# Altium project high-speed-thermocouple-logger.PrjPcb (part 2 of 3)

## Sheet power.SchDoc: tclogger
size A4; Date: 2024-05-30; CheckedBy: Boris Botev; DrawnBy: Iliyan Antov; Organization: Medical Technologies CZ a.s.; Revision: 100; SheetNumber: 3; SheetTotal: 10; Version1: N/A; Version2: N/A; Version3: N/A; Change1description: N/A; Change2description: N/A; Change3description: N/A; Change1DrawnBy: N/A; Change2DrawnBy: N/A; Change3DrawnBy: N/A; Change1CheckedBy: N/A; Change2CheckedBy: N/A; Change3CheckedBy: N/A; PreviusVersion_Chng1: N/A; PreviusVersion_Chng2: N/A; PreviusVersion_Chng3: N/A; Variant1description: Standard assembly; Variant2description: N/A; Variant3description: N/A; Variant4description: N/A; PrimaryCard1: XXXxxxXXX; PrimaryCard2: N/A; PrimaryCard3: N/A; PrimaryCard4: N/A; SPICEModelCachePWZRLVOU: <root> / <DocumentId>PWZRLVOU</DocumentId> / <CacheFrame Number="0"> / <Model Name="grm188r72a104ka35" Kind="CKT"> / <Text>*---------------------------------------------------------------------- / * SPICE Model generated by Murata Manufacturing Co., Ltd. / * Copyright(C) Murata Manufacturing Co., Ltd. / * Description :1608M(0603)/X7R/0.1uF/100V / * Murata P/N :GRM188R72A104KA35 / * Property : C = 0.1[uF] / *---------------------------------------------------------------------- / * Applicable Conditions: / *   Frequency Range = 100Hz-6GHz / *   Temperature = 25 degC / *   DC Bias Voltage = 0V / *   Small Signal Operation / *---------------------------------------------------------------------- / .SUBCKT GRM188R72A104KA35 port1 port2 / C1 port1 11 9.94e-8 / L2 11 12 1.68e-10 / R3 12 13 1.35e-2 / C4 13 14 1.39e-5 / R4 13 14 285 / C5 14 15 2.35e-5 / R5 14 15 28.5 / C6 15 16 1.88e-5 / R6 15 16 7.00 / C7 16 17 1.68e-5 / R7 16 17 9.47e-1 / C8 17 18 1.50e-5 / R8 17 18 1.51e-1 / C9 18 19 1.07e-5 / R9 18 19 2.98e-2 / C10 19 20 1.31e-5 / R10 19 20 3.83e-3 / L11 20 21 1.43e-11 / R11 20 21 8.15e-2 / L12 21 22 1.08e-10 / R12 21 22 7.26e-2 / C13 22 23 4.76e-7 / L13 22 23 2.94e-11 / R13 22 23 3.05e-2 / C14 23 24 1.58e-7 / L14 23 24 2.63e-11 / R14 23 24 2.63e-2 / C15 24 port2 3.33e-12 / L15 24 port2 1.14e-10 / R15 24 port2 22.5 / R100 port1 11 5.00e+9 / .ENDS GRM188R72A104KA35</Text> / </Model> / <Model Name="ssa34" Kind="CKT"> / <Text>********************************** / * Copyright:                     * / *   Thomatronik GmbH, Germany    * / *   info@thomatronik.de          * / ********************************** / *   SPICE3 / .subckt ssa34 1 2 / ddio 1 2 legd / dgr 1 2 grd / .model legd d is = 1.73647E-006 n = 1.01682 rs = 0.0395584 / + eg = 0.4 xti = 0.200031 tnom = 27 / + cjo = 8.10972E-010 vj = 0.700021 m = 0.588084 fc = 0.5 / + tt = 1.4427E-009 bv = 44 ibv = 1 af = 1 kf = 0 / .model grd d is = 6.76885E-008 n = 0.972506 rs = 0.0698092 / + eg = 1 xti = 0.2 tnom = 27 / .ends</Text> / </Model> / <Model Name="grt188r61h105ke13" Kind="CKT"> / <Text>*---------------------------------------------------------------------- / * SPICE Model generated by Murata Manufacturing Co., Ltd. / * Copyright(C) Murata Manufacturing Co., Ltd. / * Description :1608M(0603)/X5R/1uF/50V / * Murata P/N :GRT188R61H105KE13 / * Property : C = 1[uF] / *---------------------------------------------------------------------- / * Applicable Conditions: / *   Frequency Range = 100Hz-6GHz / *   Temperature = 25 degC / *   DC Bias Voltage = 5V / *   Small Signal Operation / *---------------------------------------------------------------------- / .SUBCKT GRT188R61H105KE13 port1 port2 / C1 port1 11 7.62e-7 / L2 11 12 1.16e-10 / R3 12 13 7.65e-3 / C4 13 14 3.94e-6 / R4 13 14 1.77e+3 / C5 14 15 1.75e-5 / R5 14 15 15.4 / C6 15 16 1.51e-5 / R6 15 16 1.76 / C7 16 17 1.17e-5 / R7 16 17 2.01e-1 / C8 17 18 8.13e-6 / R8 17 18 2.61e-2 / L9 18 19 2.29e-11 / R9 18 19 8.12e-2 / L10 19 20 1.53e-10 / R10 19 20 4.15e-2 / C11 20 21 2.62e-6 / L11 20 21 3.15e-11 / R11 20 21 1.12e-2 / C12 21 22 7.84e-7 / L12 21 22 5.54e-11 / R12 21 22 1.32e-2 / C13 22 port2 1.55e-12 / L13 22 port2 1.73e-10 / R13 22 port2 64.4 / R100 port1 11 5.00e+7 / .ENDS GRT188R61H105KE13</Text> / </Model> / <Model Name="c1608c0g1h103j080aa_p" Kind="CKT"> / <Text>*---------------------------------------------------------------------- / * SPICE Netlist Generated by TDK Corporation / * Copyright(C) 2015 TDK Corporation. / * All Rights Reserved. / *---------------------------------------------------------------------- / * TDK P/N: C1608C0G1H103J080AA (Multilayer Ceramic Chip Capacitor) / * Property: C=10nF / * Size(LxWxT): 1.6x0.8x0.8mm, 0.063x0.031x0.031inches / * Model Type: Precise Model / * Model Generated on June 29, 2015 / *---------------------------------------------------------------------- / * Terms and conditions regarding TDK Simulation Models: / * 1)This simulation model is being provided solely for informational / *   purposes. Please refer to the specifications of the products in / *   terms of detailed characteristics of such products. / * 2)In no event shall TDK Corporation of any of its subsidiaries be / *   liable for any loss or damage arising, directly or indirectly, / *   from any information contained in this simulation model, including, / *   but not limited to loss or damages arising from any inaccuracies, / *   omissions or errors in connection with such information. / * 3)Any and all copyrights on this simulation model are owned by / *   TDK Corporation.  Duplication or redistribution of this simulation / *   model without prior written permission from TDK Corporation / *   is prohibited. / * 4)This simulation model is subject to any modification or change / *   without any prior notice. / * 5)Neither TDK Corporation nor any of its subsidiaries shall make any / *   warranty, express or implied, including but not limited to the / *   correctness, implied warranties of merchantability and fitness for / *   a particular purpose with respect to this simulation models. / * 6)The use of this simulation model shall be deemed to have consented / *   to the terms and conditions hereof. / *---------------------------------------------------------------------- / * External Node Assignments: / * / *  n1 ---| |--- n2 / * / *---------------------------------------------------------------------- / * Applicable Conditions: / *   Temperature = 25 degC / *   DC Bias Voltage = 0 V / *   Small Signal Operation / *---------------------------------------------------------------------- / .SUBCKT C1608C0G1H103J080AA_p n1 n2 / C1 n1 11 1.00000000E-08 / L1 11 12 3.87447524E-10 / L2 12 13 3.02537762E-11 / L3 13 14 6.87230213E-11 / L4 14 15 1.66916342E-10 / L5 15 16 4.94708926E-10 / R1 n2 12 7.79169483E-02 / R2 n2 13 3.60336449E-02 / R3 n2 14 1.66641994E-02 / R4 n2 15 7.70656268E-03 / R5 n2 16 3.56399409E-03 / R6 n1 11 1.00000000E+10 / .ENDS C1608C0G1H103J080AA_p</Text> / </Model> / <Model Name="c1608x7r1h474k080ac_p" Kind="CKT"> / <Text>*---------------------------------------------------------------------- / * SPICE Netlist Generated by TDK Corporation / * Copyright(C) 2015 TDK Corporation. / * All Rights Reserved. / *---------------------------------------------------------------------- / * TDK P/N: C1608X7R1H474K080AC (Multilayer Ceramic Chip Capacitor) / * Property: C=470nF / * Size(LxWxT): 1.6x0.8x0.8mm, 0.063x0.031x0.031inches / * Model Type: Precise Model / * Model Generated on June 29, 2015 / *---------------------------------------------------------------------- / * Terms and conditions regarding TDK Simulation Models: / * 1)This simulation model is being provided solely for informational / *   purposes. Please refer to the specifications of the products in / *   terms of detailed characteristics of such products. / * 2)In no event shall TDK Corporation of any of its subsidiaries be / *   liable for any loss or damage arising, directly or indirectly, / *   from any information contained in this simulation model, including, / *   but not limited to loss or damages arising from any inaccuracies, / *   omissions or errors in connection with such information. / * 3)Any and all copyrights on this simulation model are owned by / *   TDK Corporation.  Duplication or redistribution of this simulation / *   model without prior written permission from TDK Corporation / *   is prohibited. / * 4)This simulation model is subject to any modification or change / *   without any prior notice. / * 5)Neither TDK Corporation nor any of its subsidiaries shall make any / *   warranty, express or implied, including but not limited to the / *   correctness, implied warranties of merchantability and fitness for / *   a particular purpose with respect to this simulation models. / * 6)The use of this simulation model shall be deemed to have consented / *   to the terms and conditions hereof. / *---------------------------------------------------------------------- / * External Node Assignments: / * / *  n1 ---| |--- n2 / * / *---------------------------------------------------------------------- / * Applicable Conditions: / *   Temperature = 25 degC / *   DC Bias Voltage = 0 V / *   Small Signal Operation / *---------------------------------------------------------------------- / .SUBCKT C1608X7R1H474K080AC_p n1 n2 / C1 n1 11 4.47810483E-07 / C2 n1 12 5.67609918E-09 / C3 n1 13 5.67609918E-09 / C4 n1 14 5.67609918E-09 / C5 n1 15 5.67609918E-09 / C6 n1 16 5.67609918E-09 / C7 n1 17 5.67609918E-09 / L1 n2 21 4.20000000E-10 / R1 11 21 9.27347124E-03 / R2 11 12 5.00450244E+01 / R3 11 13 3.23698218E+02 / R4 11 14 2.09308839E+03 / R5 11 15 1.35302521E+04 / R6 11 16 8.74376255E+04 / R7 11 17 5.64895275E+05 / R8 n1 11 1.06000000E+09 / .ENDS C1608X7R1H474K080AC_p</Text> / </Model> / </CacheFrame> / </root>; DocumentName: Docname
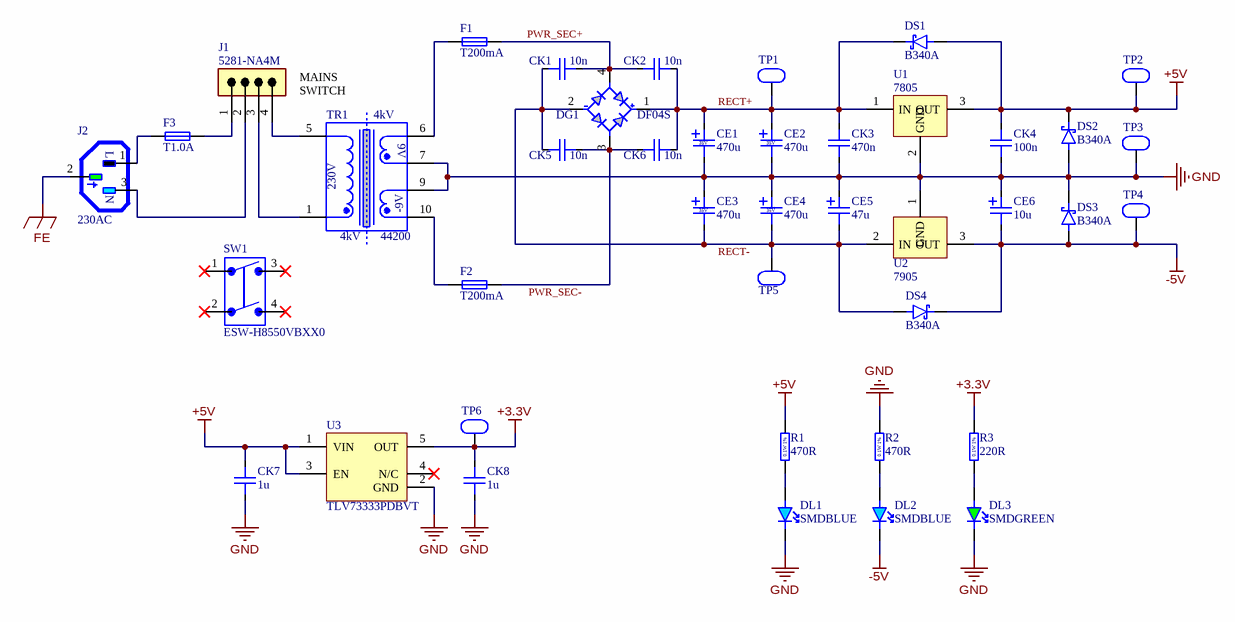
[diagram p5: power.SchDoc]

### Parts
CE1  470u  SCH_INFO: 35V
CE2  470u  SCH_INFO: 35V
CE3  470u  SCH_INFO: 35V
CE4  470u  SCH_INFO: 35V
CE5  47u  [CAPAE6.8X6.8(D_SIZE)]
CE6  10u  [CAPAE5.5X5.5(C_SIZE)]
CK1  10n  [CAPC1608X09N(SMC0603)]
CK2  10n  [CAPC1608X09N(SMC0603)]
CK3  470n  [CAPC1608X09N(SMC0603)]
CK4  100n  [CAPC1608X09N(SMC0603)]
CK5  10n  [CAPC1608X09N(SMC0603)]
CK6  10n  [CAPC1608X09N(SMC0603)]
CK7  1u  [CAPC1608X09N(SMC0603)]
CK8  1u  [CAPC1608X09N(SMC0603)]
DG1  DF04S  [DIP300RM5.08_SMD]
DL1  SMDBLUE  [DIOC2012X12N(SMLED0805)B]
DL2  SMDBLUE  [DIOC2012X12N(SMLED0805)B]
DL3  SMDGREEN  [DIOC2012X12N(SMLED0805)G]
DS1  B340A  [DIOM5127X23N(SMA)]
DS2  B340A  [DIOM5127X23N(SMA)]
DS3  B340A  [DIOM5127X23N(SMA)]
DS4  B340A  [DIOM5127X23N(SMA)]
F1  T200mA  [FUSE-C8.5]
F2  T200mA  [FUSE-C8.5]
F3  T1.0A  [FUSE-C8.5]
J1  5281-NA4M  [4P-NA-5.08]
J2  230AC  [SCHURTER_GSP1.8501.1]
R1  470R  SCH_INFO: 0.1W 1%  [RESC1608X06N(SMR0603)]
R2  470R  SCH_INFO: 0.1W 1%  [RESC1608X06N(SMR0603)]
R3  220R  SCH_INFO: 0.1W 1%  [RESC1608X06N(SMR0603)]
SW1  ESW-H8550VBXX0
TP1  Test Point  [SMD_Testpoint_Onelayer]  (value not drawn)
TP2  Test Point  [SMD_Testpoint_Onelayer]  (value not drawn)
TP3  Test Point  [SMD_Testpoint_Onelayer]  (value not drawn)
TP4  Test Point  [SMD_Testpoint_Onelayer]  (value not drawn)
TP5  Test Point  [SMD_Testpoint_Onelayer]  (value not drawn)
TP6  Test Point  [SMD_Testpoint_Onelayer]  (value not drawn)
TR1  44200  [44200]
U1  7805  [DPAK254P1544X483-3N(D2PAK)]
U2  7905  [DPAK254P1544X483-3N(D2PAK)]
U3  TLV73333PDBVT  [SOT95P280X145-5N(SOT23-5)]

### Nets
+3.3V: CK8.1 R3.2 TP6.1 U3.5(OUT)
+5V: CK4.1 CK7.1 DS1.2(A) DS2.1(C) R1.2 TP2.1 U1.3(OUT) U3.1(VIN) U3.3(EN)
-5V: CE6.2 DL2.1(C) DS3.2(A) DS4.1(C) TP4.1 U2.3(OUT)
FE: J2.2
GND: CE1.2 CE2.2 CE3.1 CE4.1 CE5.1 CE6.1 CK3.2 CK4.2 CK7.2 CK8.2 DL1.1(C) DL3.1(C) DS2.2(A) DS3.1(C) R2.2 TP3.1 TR1.7 TR1.9 U1.2(GND) U2.1(GND) U3.2(GND)
PWR_SEC+: CK1.2 CK2.1 DG1.4(AC) F1.2
PWR_SEC-: CK5.2 CK6.1 DG1.3(AC) F2.2
RECT+: CE1.1 CE2.1 CK2.2 CK3.1 CK6.2 DG1.1(+) DS1.1(C) TP1.1 U1.1(IN)
RECT-: CE3.2 CE4.2 CE5.2 CK1.1 CK5.1 DG1.2(-) DS4.2(A) TP5.1 U2.2(IN)
NetDL1_2: DL1.2(A) R1.1
NetDL2_2: DL2.2(A) R2.1
NetDL3_2: DL3.2(A) R3.1
NetF1_1: F1.1 TR1.6
NetF2_1: F2.1 TR1.10
NetF3_1: F3.1 J2.1
NetF3_2: F3.2 J1.1
NetJ1_2: J1.2 J2.3
NetJ1_3: J1.3 TR1.1
NetJ1_4: J1.4 TR1.5

Not connected (* = marked no-connect by the designer): SW1 1* 2* 3* 4*; U3 4(N/C)*

### Notes on the sheet
- MAINS SWITCH
- Číslo výkresu /drawing number/:
- Nazev listu/sheet name/:
- DPS projekt/PCB project/:
- Kreslil /drawn by/ :
- Kontroloval /checked by/:
- Datum /date/:
- List /sheet/:
- /
- (in symbol 44200) 4kV; 9V; 230V; -9V
- (in symbol EJ-GSP1SC1) L; N

### Library data of the parts
CE1-CE4 = ECE-470U35VXXM: C; 470u; 35V; 20%; Aluminum Electrolytic; ??;; Manufacturer: SU'SCON: SL035M471G16T008P50R;;SU'SCON: SL035M471G16SR;;SAMWHA: SD1V477M1012MPA159;;SAMWHA: SD1V477M1012MPA186; Component_Class: Capacitor; Status_I: Production; Status_II: Active; Tolerance_Pct: 20; Voltage_Rating_V: 35; Capacitance_F: 0.00047; Resistance_Ohm: 0.039; KK: ECE-470U35VXXM; Value: 470u; SMD: 0; ComponentLink2URL: i:\datasheets\ECE-470U35VXXM_Jamicon.pdf; ComponentLink2Description: ECE-470U35VXXM_Jamicon.pdf; Dielectric_Type: Aluminum Electrolytic; ComponentLink1URL: heliosgreen://v1/hegMT/5-MT/Classes(343)/Folders/OpenForm?RecordNumbers=[380299]; ComponentLink1Description: Helios; ComponentLink3URL: i:\datasheets\ECE-470U35VXXM_SamwhaEN100.pdf; ComponentLink3Description: ECE-470U35VXXM_SamwhaEN100.pdf
CE5 = ECE+47U35VXX0: C; 47u; 35V; 20%; Aluminum Electrolytic; ??;; Manufacturer: Surge, MPN: SVZ21V470M0605V1; Component_Class: Capacitor; Status_I: Production; Status_II: Active; Tolerance_Pct: 20; Voltage_Rating_V: 35; Capacitance_F: 4.7E-5; KK: ECE+47U35VXX0; Value: 47u; SMD: 1; ComponentLink2URL: I:\DataSheets\ECE+47U35VXX0_SurgeEN100.pdf; ComponentLink2Description: ECE+47U35VXX0_SurgeEN100.pdf; Dielectric_Type: Aluminum Electrolytic; ComponentLink1URL: heliosgreen://v1/hegMT/5-MT/Classes(343)/Folders/OpenForm?RecordNumbers=[18329439]; ComponentLink1Description: Helios
CE6 = ECE+10U35VXXM: C; 10u; 35V; 20%; Aluminum Electrolytic; ??;; Manufacturer: SAMWHA: SC1V106M05005VR259;;SAMWHA: SC1V106M05005VR289; Component_Class: Capacitor; Status_I: Production; Status_II: Active; Tolerance_Pct: 20; Voltage_Rating_V: 35; Capacitance_F: 1E-5; KK: ECE+10U35VXXM; Value: 10u; SMD: 1; ComponentLink2URL: i:\datasheets\ECE+10U35VXXM_Nippon.pdf; ComponentLink2Description: ECE+10U35VXXM_Nippon.pdf; ComponentLink3URL: i:\datasheets\ECE+10U35VXXM_Jamicon.pdf; ComponentLink3Description: ECE+10U35VXXM_Jamicon.pdf; ComponentLink4URL: i:\datasheets\ECE+10U35VXXM_Panasonic_serie_ECEV.pdf; ComponentLink4Description: ECE+10U35VXXM_Panasonic_serie_ECEV.pdf; ComponentLink5URL: i:\DataSheets\ECE+10U35VXXM_Shamwha.pdf; ComponentLink5Description: ECE+10U35VXXM_Shamwha.pdf; ComponentLink6URL: i:\DataSheets\SMD_parts_pictures\ECE+10U35VXXM-a.jpg; ComponentLink6Description: ECE+10U35VXXM-a.jpg; ComponentLink7URL: i:\DataSheets\SMD_parts_pictures\ECE+10U35VXXM-b.jpg; ComponentLink7Description: ECE+10U35VXXM-b.jpg; ComponentLink8URL: i:\DataSheets\SMD_parts_pictures\ECE+10U35VXXM-c.jpg; ComponentLink8Description: ECE+10U35VXXM-c.jpg; Resistance_Ohm: 20; Dielectric_Type: Aluminum Electrolytic; ComponentLink1URL: heliosgreen://v1/hegMT/5-MT/Classes(343)/Folders/OpenForm?RecordNumbers=[380259]; ComponentLink1Description: Helios
CK1 CK2 CK5 CK6 = ECK+10N50V0603XX0: C; 10n; 50V; 5%; NP0/C0G; ??;; Manufacturer: TDK: C1608C0G1H103J080AA; Component_Class: Capacitor; Status_I: Production; Status_II: Do not order. Upon confirmation.; Tolerance_Pct: 5; Voltage_Rating_V: 50; Capacitance_F: 1E-8; KK: ECK+10N50V0603XX0; Value: 10n; SMD: 1; ComponentLink2URL: I:\DataSheets\ECK+10N50V0603XX0_TdkEN100.pdf; ComponentLink2Description: ECK+10N50V0603XX0_TdkEN100.pdf; Dielectric_Type: NP0/C0G; ComponentLink1URL: heliosgreen://v1/hegMT/5-MT/Classes(343)/Folders/OpenForm?RecordNumbers=[12587254]; ComponentLink1Description: Helios
CK3 = ECK+470N50V0603XXK: C; 470n; 50V; 10%; X7R; ??;; Manufacturer: TDK: C1608X7R1H474KT-S;;TDK: C1608X7R1H474KT000E;;TDK: C1608X7R1H474K080AC; Note: X7R: 440n @ 5V, 330n @ 12V, 170n @ 25V (TDK); Component_Class: Capacitor; Status_I: Production; Status_II: Active; Tolerance_Pct: 10; Voltage_Rating_V: 50; Capacitance_F: 4.7E-7; KK: ECK+470N50V0603XXK; Value: 470n; SMD: 1; ComponentLink2URL: i:\datasheets\ECK+470N50V0603XXK_TDKEN100.pdf; ComponentLink2Description: ECK+470N50V0603XXK_TDKEN100.pdf; Dielectric_Type: X7R; ComponentLink1URL: heliosgreen://v1/hegMT/5-MT/Classes(343)/Folders/OpenForm?RecordNumbers=[6094421]; ComponentLink1Description: Helios
CK4 = ECK+100N100VXX0: C; 100n; 100V; 10%; X7R; ??;; Manufacturer: Murata Electronics: GRM188R72A104KA35D;;Yageo: CC0603KRX7R0BB104; Component_Class: Capacitor; Status_I: Production; Status_II: Active; Tolerance_Pct: 10; Voltage_Rating_V: 100; Capacitance_F: 1E-7; KK: ECK+100N100VXX0; Value: 100n; SMD: 1; ComponentLink2URL: I:\DataSheets\ECK+100N100VXX0_MurataEN100.pdf; ComponentLink2Description: ECK+100N100VXX0_MurataEN100.pdf; ComponentLink3URL: I:\DataSheets\ECK+100N100VXX0_YageoEN100.pdf; ComponentLink3Description: ECK+100N100VXX0_YageoEN100.pdf; ComponentLink4URL: i:\DataSheets\ECK+100N100VXX0_2_MurataEN100.pdf; ComponentLink4Description: ECK+100N100VXX0_2_MurataEN100.pdf; ComponentLink5URL: i:\DataSheets\ECK+100N100VXX0_2_YageoEN100.pdf; ComponentLink5Description: ECK+100N100VXX0_2_YageoEN100.pdf; Dielectric_Type: X7R; ComponentLink1URL: heliosgreen://v1/hegMT/5-MT/Classes(343)/Folders/OpenForm?RecordNumbers=[10556034]; ComponentLink1Description: Helios
CK7 CK8 = ECK+1U50VXX0: C; 1u; 50V; 10%; X5R; ??;; Manufacturer: TDK: C1608X5R1H105K080AB;;TDK: CGA3E3X5R1H105K080AB;;Murata: GRT188R61H105KE13D;;AVX: 06035D105KAT2A; Note: X5R: 0.52uF @ 10V, 0.2uF @ 25V (Murata); Component_Class: Capacitor; Status_I: Production; Status_II: Active; Tolerance_Pct: 10; Voltage_Rating_V: 50; Capacitance_F: 1E-6; KK: ECK+1U50VXX0; Value: 1u; SMD: 1; ComponentLink2URL: i:\DataSheets\ECK+1U50VXX0_TDKEN100.pdf; ComponentLink2Description: ECK+1U50VXX0_TDKEN100.pdf; ComponentLink3URL: I:\DataSheets\ECK+1U50VXX0_AVX_EN100.pdf; ComponentLink3Description: ECK+1U50VXX0_AVX_EN100.pdf; ComponentLink4URL: I:\DataSheets\ECK+1U50VXX0_MurataEN100.pdf; ComponentLink4Description: ECK+1U50VXX0_MurataEN100.pdf; ComponentLink5URL: I:\DataSheets\ECK+1U50VXX0_TDK_EN101.pdf; ComponentLink5Description: ECK+1U50VXX0_TDK_EN101.pdf; ComponentLink6URL: i:\DataSheets\ECK+1U50VXX0_2_AVX_EN100.pdf; ComponentLink6Description: ECK+1U50VXX0_2_AVX_EN100.pdf; Dielectric_Type: X5R; ComponentLink1URL: heliosgreen://v1/hegMT/5-MT/Classes(343)/Folders/OpenForm?RecordNumbers=[9390428]; ComponentLink1Description: Helios
DG1 = EDG+DF04SXX0: D; Bridge; 400V; 1A; 1x;; Manufacturer: YYE: DB107S T/R;;MicroElectronics: DB107S T/R;;GENERAL SEMICONDUCTOR: DF04S(A);;FAI: DF04S;;DIOTEC: B250(F)S; Component_Class: Diode; Status_I: Production; Status_II: Active; Multiplicity: 1; Reverse_Voltage_Rating_V: 400; KK: EDG+DF04SXX0; Value: DF04S; SMD: 1; ComponentLink2URL: i:\DataSheets\EDG+DF04SXX0_Vishay.pdf; ComponentLink2Description: EDG+DF04SXX0_Vishay.pdf; ComponentLink3URL: i:\DataSheets\EDG+DF04SXX0_Fairchild.pdf; ComponentLink3Description: EDG+DF04SXX0_Fairchild.pdf; ComponentLink4URL: i:\DataSheets\SMD_parts_pictures\EDG+DF04SXX0-a.jpg; ComponentLink4Description: EDG+DF04SXX0-a.jpg; Current_Rating_A: 1; Diode_Type: Bridge; ComponentLink1URL: heliosgreen://v1/hegMT/5-MT/Classes(343)/Folders/OpenForm?RecordNumbers=[380577]; ComponentLink1Description: Helios
DL1 DL2 = EDL+SMDBLUEXX0: Ind; Light; Blue;; Manufacturer: MULTICOMP: OVS-0803; Note: 465nm; Component_Class: Indicator; Status_I: Production; Status_II: Active; KK: EDL+SMDBLUEXX0; Value: SMDBLUE; SMD: 1; ComponentLink2URL: i:\DataSheets\EDL+SMDBLUEXX0_Multicomp.pdf; ComponentLink2Description: EDL+SMDBLUEXX0_Multicomp.pdf; Indicator_Type: Light; Indicator_Output: Blue; ComponentLink1URL: heliosgreen://v1/hegMT/5-MT/Classes(343)/Folders/OpenForm?RecordNumbers=[3654099]; ComponentLink1Description: Helios
DL3 = EDL+SMDGREENXX0: Ind; Light; Green;; Manufacturer: HEBEI: 0805KGCT;;BRIGHTLED: BL-HGE35A-AV-TRB; Note: 570nm; Component_Class: Indicator; Status_I: Production; Status_II: Active; KK: EDL+SMDGREENXX0; Value: SMDGREEN; SMD: 1; ComponentLink2URL: i:\datasheets\EDL+SMDGREENXX0_KingBright.pdf; ComponentLink2Description: EDL+SMDGREENXX0_KingBright.pdf; ComponentLink3URL: i:\DataSheets\EDL+SMDGREENXX0_Hebei_EN100.pdf; ComponentLink3Description: EDL+SMDGREENXX0_Hebei_EN100; ComponentLink4URL: i:\DataSheets\EDL+SMDGREENXX0_Brightled_EN100.pdf; ComponentLink4Description: EDL+SMDGREENXX0_Brightled_EN100; Indicator_Type: Light; Indicator_Output: Green; ComponentLink1URL: heliosgreen://v1/hegMT/5-MT/Classes(343)/Folders/OpenForm?RecordNumbers=[380588]; ComponentLink1Description: Helios
DS1-DS4 = EDS+B340AXX0: D; Schottky; 40V; 3A; 1x;; Manufacturer: DIODES INC: B340A-13-F;;ONS: MBRA340T3G;;VISHAY: SSA34;;BOURNS: B340LF;;MCC: SK34A-LTP; Component_Class: Diode; Status_I: Production; Status_II: Active; Multiplicity: 1; Current_Rating_A: 3; Reverse_Voltage_Rating_V: 40; KK: EDS+B340AXX0; Value: B340A; SMD: 1; ComponentLink2URL: i:\DataSheets\EDS+B340AXX0_Vishay.pdf; ComponentLink2Description: EDS+B340AXX0_Vishay.pdf; ComponentLink3URL: i:\datasheets\EDS+B340AXX0_OnSemi.pdf; ComponentLink3Description: EDS+B340AXX0_OnSemi.pdf; ComponentLink4URL: i:\DataSheets\EDS+B340AXX0_Diodes.pdf; ComponentLink4Description: EDS+B340AXX0_Diodes.pdf; ComponentLink5URL: i:\datasheets\EDS+B340AXX0_Bourns.pdf; ComponentLink5Description: EDS+B340AXX0_Bourns.pdf; ComponentLink6URL: I:\DataSheets\EDS+B340AXX0_MCCEN100.pdf; ComponentLink6Description: EDS+B340AXX0_MCCEN100.pdf; Diode_Type: Schottky; ComponentLink1URL: heliosgreen://v1/hegMT/5-MT/Classes(343)/Folders/OpenForm?RecordNumbers=[4517485]; ComponentLink1Description: Helios
F1 F2 = EF-MST0.2ASC0: CP; Current [A]; 0.2; R:No; 1x;; Manufacturer: SCHURTER: MST250 0034.6608;;SCHURTER: MST250 0034.6708; Component_Class: Circuit Protection; Status_I: Production; Status_II: Active; Multiplicity: 1; Resettable: No; Trip_Threshold: 0.2; KK: EF-MST0.2ASC0; Value: T200mA; SMD: 0; ComponentLink2URL: i:\DataSheets\EF-MST_250_Schurter.pdf; ComponentLink2Description: EF-MST_250_Schurter.pdf; Physical_Quantity: Current [A]; ComponentLink1URL: heliosgreen://v1/hegMT/5-MT/Classes(343)/Folders/OpenForm?RecordNumbers=[380401]; ComponentLink1Description: Helios
F3 = EF-MST1.0ASC0: CP; Current [A]; 1; R:No; 1x;; Manufacturer: SCHURTER: 34,6615; Component_Class: Circuit Protection; Status_I: Production; Status_II: Active; Multiplicity: 1; Resettable: No; KK: EF-MST1.0ASC0; Value: T1.0A; SMD: 0; ComponentLink2URL: i:\DataSheets\EF-MSTxASC0_Schurter.pdf; ComponentLink2Description: EF-MSTxASC0_Schurter.pdf; ComponentLink3URL: i:\DataSheets\EF-MST_250_Schurter.pdf; ComponentLink3Description: EF-MST_250_Schurter.pdf; Physical_Quantity: Current [A]; Trip_Threshold: 1; ComponentLink1URL: heliosgreen://v1/hegMT/5-MT/Classes(343)/Folders/OpenForm?RecordNumbers=[380402]; ComponentLink1Description: Helios
J1 = EJ-5281-NA4MX0: Con; Wire to board RM5.04; 4x; PCB; Straight; 250V; 7A; Male; Tin; ??;; Manufacturer: HSUAN MAO: W4508-04PSYTW0R;;HSM: W4508-04PSYTW0R;;MOLEX: 10-32-1041; Component_Class: Connector; Status_I: Production; Status_II: Active; Multiplicity: 4; Voltage_Rating_V: 250; Current_Rating_A: 7; KK: EJ-5281-NA4MX0; Value: 5281-NA4M; SMD: 0; ComponentLink2URL: i:\datasheets\EJ-5281-NA4MX0_HSUAN MAO.pdf; ComponentLink2Description: EJ-5281-NA4MX0_HSUAN MAO.pdf; ComponentLink3URL: i:\datasheets\EJ-5281-NA4MX0_MOLEX.pdf; ComponentLink3Description: EJ-5281-NA4MX0_MOLEX.pdf; Mounting_Style: PCB; Connector_Family: Wire to board RM5.04; Angle: Straight; Gender: Male; Plating: Tin; ComponentLink1URL: heliosgreen://v1/hegMT/5-MT/Classes(343)/Folders/OpenForm?RecordNumbers=[380714]; ComponentLink1Description: Helios; System: Connector
J2 = EJ-GSP1SC1: Con; AC plug; 1x; PCB; ??; 250V; 10A; Male; Tin; ??;; Manufacturer: SCHURTER: GSP1.8501.1; Note: C14; Component_Class: Connector; Status_I: Production; Status_II: Active; Multiplicity: 1; Voltage_Rating_V: 250; Current_Rating_A: 10; Connector_Family: AC plug; KK: EJ-GSP1SC1; SMD: 0; ComponentLink2URL: i:\DataSheets\EJ-GSP1SC1_Schurter.pdf; ComponentLink2Description: EJ-GSP1SC1_Schurter.pdf; ComponentLink3URL: i:\DataSheets\EJ-GSP1SC1_Schurter1.pdf; ComponentLink3Description: EJ-GSP1SC1_Schurter1.pdf; Mounting_Style: PCB; Gender: Male; Plating: Tin; ComponentLink1URL: heliosgreen://v1/hegMT/5-MT/Classes(343)/Folders/OpenForm?RecordNumbers=[380789]; ComponentLink1Description: Helios; System: Connector
R1 = ER+470R0.1WXX2: R; 470R; 0.1W; 1%; 75V; Thick Film; ±100ppm/K; 1x;; Manufacturer: Yageo: RC0603FR-07470RL;;Panasonic: ERJ3EKF4700V; Component_Class: Resistor; Status_I: Production; Status_II: Active; Tolerance_Pct: 1; Resistance_Ohm: 470; Power_Rating_W: 0.1; Temperature_Coefficient_PPMpK: ±100; Voltage_Rating_V: 75; KK: ER+470R0.1WXX2; Value: 470R; SMD: 1; ComponentLink2URL: I:\DataSheets\ER+470R0.1WXX2_YageoEN100.pdf; ComponentLink2Description: ER+470R0.1WXX2_YageoEN100.pdf; Multiplicity: 1; Resistor_Type: Thick Film; ComponentLink1URL: heliosgreen://v1/hegMT/5-MT/Classes(343)/Folders/OpenForm?RecordNumbers=[11656564]; ComponentLink1Description: Helios; ComponentLink3URL: I:\datasheets\ER+470R0.1WXX2_PanasonicEN100.pdf; ComponentLink3Description: ER+470R0.1WXX2_PanasonicEN100.pdf
R2 = ER+470R0.1WXX2: R; 470R; 0.1W; 1%; 75V; Thick Film; ±100ppm/K; 1x;; Manufacturer: Yageo: RC0603FR-07470RL;;Panasonic: ERJ3EKF4700V; Component_Class: Resistor; Status_I: Production; Status_II: Active; Tolerance_Pct: 1; Voltage_Rating_V: 75; Resistance_Ohm: 470; Power_Rating_W: 0.1; Temperature_Coefficient_PPMpK: ±100; KK: ER+470R0.1WXX2; Value: 470R; SMD: 1; ComponentLink2URL: I:\DataSheets\ER+470R0.1WXX2_YageoEN100.pdf; ComponentLink2Description: ER+470R0.1WXX2_YageoEN100.pdf; Multiplicity: 1; Resistor_Type: Thick Film; ComponentLink1URL: heliosgreen://v1/hegMT/5-MT/Classes(343)/Folders/OpenForm?RecordNumbers=[11656564]; ComponentLink1Description: Helios; ComponentLink3URL: I:\datasheets\ER+470R0.1WXX2_PanasonicEN100.pdf; ComponentLink3Description: ER+470R0.1WXX2_PanasonicEN100.pdf
R3 = ER+220R0.1W0603XX0: R; 220R; 0.1W; 1%; 75V; Thick Film; ±100ppm/K; 1x;; Manufacturer: VISHAY: CRCW0603220RFKEA; Component_Class: Resistor; Status_I: Production; Status_II: Active; Tolerance_Pct: 1; Voltage_Rating_V: 75; Resistance_Ohm: 220; Power_Rating_W: 0.1; Temperature_Coefficient_PPMpK: ±100; KK: ER+220R0.1W0603XX0; Value: 220R; SMD: 1; ComponentLink2URL: I:\datasheets\ER+220R0.1W0603XX0_VISHAY_EN100.pdf; ComponentLink2Description: ER+220R0.1W0603XX0_VISHAY_EN100.pdf; Multiplicity: 1; Resistor_Type: Thick Film; ComponentLink1URL: heliosgreen://v1/hegMT/5-MT/Classes(343)/Folders/OpenForm?RecordNumbers=[10455718]; ComponentLink1Description: Helios
SW1 = ESW-H8550VBXX0: MSw; DPST; Panel; 2x; DC:??V; DC:??A; AC:250V; AC:9A; CV:??V; Switch;; Manufacturer: SWITRONIC: R19-20.BBBT;;SWITRONIC: R19-20.BBBT+-G; Note: According to VDE certificate, current up to 4A.; Component_Class: Mechanical Switch; Status_I: Production; Status_II: Active; Multiplicity: 2; Current_Rating_AC_A: 9; Voltage_Rating_AC_V: 250; KK: ESW-H8550VBXX0; SMD: 0; ComponentLink2URL: i:\datasheets\ECOM_declaration of conformity.pdf; ComponentLink2Description: ECOM_declaration of conformity.pdf; ComponentLink3URL: i:\datasheets\ESW-H8550VBXX0_Switronic_page1.gif; ComponentLink3Description: ESW-H8550VBXX0_Switronic_page1.gif; ComponentLink4URL: i:\datasheets\ESW-H8550VBXX0_Switronic_page2.gif; ComponentLink4Description: ESW-H8550VBXX0_Switronic_page2.gif; ComponentLink5URL: I:\DataSheets\Switronic_declaration_LightCountry.pdf; ComponentLink5Description: Switronic_declaration_LightCountry.pdf; Mounting_Style: Panel; Switch_Configuration: DPST; Mechanical_Switch_Type: Switch; ComponentLink1URL: heliosgreen://v1/hegMT/5-MT/Classes(343)/Folders/OpenForm?RecordNumbers=[382013]; ComponentLink1Description: Helios
TP1-TP6 = EJ+TESTPOINTXX0: as TP7 on sheet filter; KK: EJ+TESTPOINTXX0; Value: Test Point; SMD: 1; ComponentLink2URL: i:\datasheets\EJ+TESTPOINTXX0_HarwinEN100.pdf; ComponentLink2Description: EJ+TESTPOINTXX0_HarwinEN100.pdf; ComponentLink3URL: i:\datasheets\EJ+TESTPOINTXX0_BoardWareEN100.pdf; ComponentLink3Description: EJ+TESTPOINTXX0_BoardWareEN100.pdf; Mounting_Style: PCB; Connector_Family: Test Point; Plating: Tin; Connector_Part: Contact; ComponentLink1URL: heliosgreen://v1/hegMT/5-MT/Classes(343)/Folders/OpenForm?RecordNumbers=[5618398]; ComponentLink1Description: Helios; System: Connector
TR1 = 44200: Transformer 230V/2x9V, 2x178mA; ComponentLink1Description: Datasheet; ComponentLink1URL: https://www.tme.eu/Document/cb1d7fdbe3570188ff28030ca3a4f1cf/Catalogue%20Myrra%202018%20compress%C3%A9.pdf
U1 = L7805AC: Fixed, Three Terminal Pos  Regulator 5V/1A in D2PAK; ComponentLink1Description: Datasheet; ComponentLink1URL: https://www.farnell.com/datasheets/1805459.pdf
U2 = L7905AC: Fixed, Three Terminal Pos  Regulator -5V/1A in D2PAK; ComponentLink1Description: Datasheet; ComponentLink1URL: https://www.farnell.com/datasheets/2581705.pdf
U3 = EU+TLV73333PDBVTXX0: IC; Linear Regulator/Reference; ??V; 5.5V; 1x;; Manufacturer: Texas Instruments: TLV73333PDBVT; Note: 3.3V, 300mA, 1% (1.4% max), Capacitor Free,Low Dropout Regulator; Status_I: Production; Status_II: Active; Multiplicity: 1; Vmax_V: 5.5; KK: EU+TLV73333PDBVTXX0; Value: TLV73333PDBVT; Component_Class: IC; SMD: 1; ComponentLink2URL: I:\DataSheets\EU+TLV73333PDBVTXX0_TexasEN100.pdf; ComponentLink2Description: EU+TLV73333PDBVTXX0_TexasEN100.pdf; IC_Type: Linear Regulator/Reference; ComponentLink1URL: heliosgreen://v1/hegMT/5-MT/Classes(343)/Folders/OpenForm?RecordNumbers=[10961858]; ComponentLink1Description: Helios

## Sheet inamp.SchDoc: tclogger
size A4; Date: 2024-05-30; CheckedBy: Boris Botev; DrawnBy: Iliyan Antov; Organization: Medical Technologies CZ a.s.; Revision: 100; SheetNumber: 7; SheetTotal: 10; Version1: N/A; Version2: N/A; Version3: N/A; Change1description: N/A; Change2description: N/A; Change3description: N/A; Change1DrawnBy: N/A; Change2DrawnBy: N/A; Change3DrawnBy: N/A; Change1CheckedBy: N/A; Change2CheckedBy: N/A; Change3CheckedBy: N/A; PreviusVersion_Chng1: N/A; PreviusVersion_Chng2: N/A; PreviusVersion_Chng3: N/A; Variant1description: Standard assembly; Variant2description: N/A; Variant3description: N/A; Variant4description: N/A; PrimaryCard1: XXXxxxXXX; PrimaryCard2: N/A; PrimaryCard3: N/A; PrimaryCard4: N/A; SPICEModelCacheOITHGSGB: <root> / <DocumentId>OITHGSGB</DocumentId> / <CacheFrame Number="0"> / <Model Name="cl32b106kbjnnn" Kind="CKT"> / <Text>* CL32B106KBJNNN Multilayer Ceramic Capacitor Spice Model / *----------------------------------------------------------------------------------------------- / * Model Generated by Samsung Electro-Mechanics / * Samsung Spice Model Version 4.0 / * Products : Multilayer Ceramic Capacitor(General) / *----------------------------------------------------------------------------------------------- / * Characteristics : / * / *     Nominal Capacitance = 10uF / *     Capacitance Tolerance = +/-10% / *     TCC = X7R(-55 ~ +125 Cels.) / *     Rated Voltage = 50Vdc / *     Size = 1210(unit:inch), 3225(unit:mm) / *     Length = 3.20 +/-0.30 mm / *     Width = 2.50 +/-0.20 mm / *     Thickness = 2.50 +/-0.20 mm / *     Measurement Temperature : 25Cels. / *     DC bias Value = 0V / *     Frequency : 100Hz ~ 6GHz / *----------------------------------------------------------------------------------------------- / * External Node Assignments : / * / *  1  o---||---o  2 / * / *----------------------------------------------------------------------------------------------- / .SUBCKT CL32B106KBJNNN 1 2 / C1 1 3 9.44968E-06 / C16 17 18 2.53303E-04 / C17 18 19 4.31538E-04 / C18 19 20 3.87143E-03 / C19 20 21 4.05486E-04 / C2 3 4 3.89833E-04 / C20 21 22 2.20709E-04 / C21 22 23 2.77761E-04 / C22 23 24 2.53303E-04 / C23 24 25 1.34605E-05 / C24 25 26 2.30531E-05 / C25 26 27 1.16610E-06 / C26 27 28 4.91406E-11 / C27 28 2 4.09488E-11 / C3 4 5 5.39533E-04 / C4 5 6 5.73260E-04 / C5 6 7 5.11364E-04 / C6 7 8 1.93016E-04 / C7 8 9 1.00000E-10 / C8 9 10 1.00000E-10 / R1 1 3 1.00000E+08 / R11 12 13 2.42949E-02 / R12 13 14 9.10435E-02 / R13 14 15 1.00000E-06 / R14 15 16 1.00000E-06 / R15 16 17 1.00000E-06 / R16 17 18 1.00000E-06 / R17 18 19 7.62309E-04 / R18 19 20 1.20099E-04 / R19 20 21 5.28440E-04 / R2 3 4 3.45620E+00 / R20 21 22 1.50623E-04 / R21 22 23 4.44357E-05 / R22 23 24 1.00000E-06 / R23 24 25 1.36432E-02 / R24 25 26 6.31685E-03 / R25 26 27 1.00465E-02 / R26 27 28 2.29510E+00 / R27 28 2 6.94002E-01 / R3 4 5 3.47991E-01 / R4 5 6 4.97604E-02 / R5 6 7 9.12642E-03 / R6 7 8 2.25502E-03 / R7 8 9 1.00000E-06 / R8 9 10 1.00000E-06 / R9 10 11 1.05460E-03 / L10 11 12 1.83919E-10 / L11 12 13 2.29964E-10 / L12 13 14 6.97785E-11 / L13 14 15 1.00000E-10 / L14 15 16 1.00000E-10 / L15 16 17 1.00000E-10 / L16 17 18 1.00000E-10 / L17 18 19 1.39420E-10 / L18 19 20 1.12292E-11 / L19 20 21 4.19321E-11 / L20 21 22 4.59803E-11 / L21 22 23 1.53628E-11 / L22 23 24 1.00000E-10 / L23 24 25 1.99071E-10 / L24 25 26 4.97469E-11 / L25 26 27 3.21804E-10 / L26 27 28 6.99616E-11 / L27 28 2 2.09205E-11 / .ENDS CL32B106KBJNNN</Text> / </Model> / <Model Name="bat54" Kind="CKT"> / <Text>* / .SUBCKT BAT54 1 2 3 / * The Resistor R1 does not reflect / * a physical device.  Instead it / * improves modeling in the reverse / * mode of operation. / * / R1 1 3 3.6E+07 / R2 2 3 3.6E+07 / D1 1 3 BAT54 / D2 3 2 BAT54 / * / .MODEL BAT54 D( / +    IS = 2.117E-07 / +    N = 1.016 / +    BV = 36 / +    IBV = 1.196E-06 / +    RS = 2.637 / +    CJO = 1.114E-11 / +    VJ = 0.2013 / +    M = 0.3868 / +    FC = 0 / +    TT = 0 / +    EG = 0.69 / +    XTI = 2) / * / .ENDS</Text> / </Model> / <Model Name="cl21c221jbannn" Kind="CKT"> / <Text>* CL21C221JBANNN Multilayer Ceramic Capacitor Spice Model / *----------------------------------------------------------------------------------------------- / * Model Generated by Samsung Electro-Mechanics / * Samsung Spice Model Version 4.0 / * Products : Multilayer Ceramic Capacitor(General) / *----------------------------------------------------------------------------------------------- / * Characteristics : / * / *     Nominal Capacitance = 220pF / *     Capacitance Tolerance = +/-5% / *     TCC = C0G(-55 ~ +125 Cels.) / *     Rated Voltage = 50Vdc / *     Size = 0805(unit:inch), 2012(unit:mm) / *     Length = 2.00 +/-0.10 mm / *     Width = 1.25 +/-0.10 mm / *     Thickness = 0.65 +/-0.10 mm / *     Measurement Temperature : 25Cels. / *     DC bias Value = 0V / *     Frequency : 10000000Hz ~ 20GHz / *----------------------------------------------------------------------------------------------- / * External Node Assignments : / * / *  1  o---||---o  2 / * / *----------------------------------------------------------------------------------------------- / .SUBCKT CL21C221JBANNN 1 2 / C1 1 3 2.20000E-10 / C2 4 9 2.13740E-10 / L1 4 5 7.94570E-11 / L2 5 6 4.09420E-11 / L3 6 7 5.74380E-11 / L4 7 8 7.76920E-12 / L5 2 8 3.17500E-10 / R1 1 3 1.00000E+11 / R2 3 4 3.90940E-02 / R3 5 9 5.49330E-01 / R4 5 6 1.49620E-02 / R5 6 7 1.28550E-01 / R6 7 8 1.65170E+00 / .ENDS CL21C221JBANNN</Text> / </Model> / </CacheFrame> / </root>; DocumentName: Docname
Used 4 times, as channels U_inamp1, U_inamp2, U_inamp3, U_inamp4. Parts and nets are listed once, with the designators drawn on the sheet.
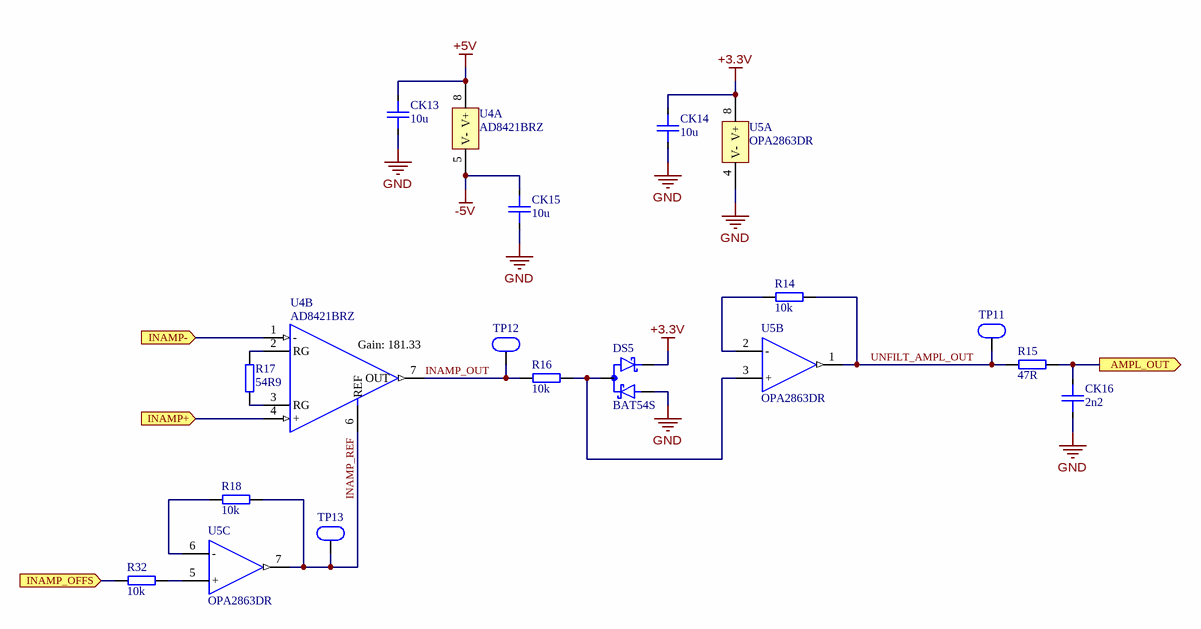
[diagram p6: inamp.SchDoc]

### Parts
CK13  10u  [CAPC3225X27N(SMC1210)]
CK14  10u  [CAPC3225X27N(SMC1210)]
CK15  10u  [CAPC3225X27N(SMC1210)]
CK16  2n2  [CAPC2012X14N(SMC0805)]
DS5  BAT54S  [SOT95P230X110-3N(SOT23)]
R14  10k  [RESC2012X06N(SMR0805)]
R15  47R  [RESC2012X06N(SMR0805)]
R16  10k  [RESC2012X06N(SMR0805)]
R17  54R9  [RESC1608X06N(SMR0603)]
R18  10k  [RESC2012X06N(SMR0805)]
R32  10k  [RESC2012X06N(SMR0805)]
TP11  Test Point  [SMD_Testpoint_Onelayer]  (value not drawn)
TP12  Test Point  [SMD_Testpoint_Onelayer]  (value not drawn)
TP13  Test Point  [SMD_Testpoint_Onelayer]  (value not drawn)
U4  AD8421BRZ  [SOIC127P600X175-8N(SOIC_8)]  (parts A,B of 2)
U5  OPA2863DR  [SOIC127P600X175-8N(SOIC_8)]  (parts A,B,C of 3)

### Ports
AMPL_OUT (out), INAMP+ (in), INAMP- (in), INAMP_OFFS (in)

### Nets
+3.3V: CK14.1 DS5.2(C2) U5.8(V+)
+5V: CK13.1 U4.8(V+)
-5V: CK15.1 U4.5(V-)
GND: CK13.2 CK14.2 CK15.2 CK16.2 DS5.1(A1) U5.4(V-)
AMPL_OUT: CK16.1 R15.1 ; port AMPL_OUT
INAMP+: U4.4(+) ; port INAMP+
INAMP-: U4.1(-) ; port INAMP-
INAMP_OFFS: R32.2 ; port INAMP_OFFS
INAMP_OUT: R16.2 TP12.1 U4.7(OUT)
INAMP_REF: R18.1 TP13.1 U4.6(REF) U5.7(OUT2)
UNFILT_AMPL_OUT: R14.1 R15.2 TP11.1 U5.1(OUT1)
NetDS5_3: DS5.3(C1A2) R16.1 U5.3(+)
NetR14_2: R14.2 U5.2(-)
NetR17_1: R17.1 U4.3(RG)
NetR17_2: R17.2 U4.2(RG)
NetR18_2: R18.2 U5.6(-)
NetR32_1: R32.1 U5.5(+)

### Channels
U_inamp1: designators end in A; ports AMPL_OUT=AMPL_OUT1 INAMP+=INAMP+1 INAMP-=INAMP-1 INAMP_OFFS=INAMP_OFFS
U_inamp2: designators end in B; ports AMPL_OUT=AMPL_OUT2 INAMP+=INAMP+2 INAMP-=INAMP-2 INAMP_OFFS=INAMP_OFFS
U_inamp3: designators end in C; ports AMPL_OUT=AMPL_OUT3 INAMP+=INAMP+3 INAMP-=INAMP-3 INAMP_OFFS=INAMP_OFFS
U_inamp4: designators end in D; ports AMPL_OUT=AMPL_OUT4 INAMP+=INAMP+4 INAMP-=INAMP-4 INAMP_OFFS=INAMP_OFFS

### Notes on the sheet
- (near U4) Gain: 181.33
- Číslo výkresu /drawing number/:
- Nazev listu/sheet name/:
- DPS projekt/PCB project/:
- Kreslil /drawn by/ :
- Kontroloval /checked by/:
- Datum /date/:
- List /sheet/:
- /

### Library data of the parts
CK13-CK15 = ECK+10U50VXX0: C; 10u; 50V; 10%; X7R; ??;; Manufacturer: Murata: GRM32ER71H106KA12L;;Samsung Electro-mechanics: CL32B106KBJNNNE; Note: X7R, 9uF @ 10V, 5uF @ 30V, 2.5uF @ 50V; Component_Class: Capacitor; Status_I: Production; Status_II: Active; Tolerance_Pct: 10; Voltage_Rating_V: 50; Capacitance_F: 1E-5; KK: ECK+10U50VXX0; Value: 10u; SMD: 1; ComponentLink2URL: I:\DataSheets\ECK+10U50VXX0_MurataEN100.pdf; ComponentLink2Description: ECK+10U50VXX0_MurataEN100.pdf; ComponentLink3URL: I:\DataSheets\ECK+10U50VXX0_SamsungEN100.pdf; ComponentLink3Description: ECK+10U50VXX0_SamsungEN100.pdf; Dielectric_Type: X7R; ComponentLink1URL: heliosgreen://v1/hegMT/5-MT/Classes(343)/Folders/OpenForm?RecordNumbers=[10658879]; ComponentLink1Description: Helios
CK16 = ECK+2N250VXXJ: C; 2n2; 50V; 5%; NP0/C0G; ??;; Manufacturer: SAMSUNG: CL21C222JBFNNNE;;SAMSUNG: CL21C222JBFNNNF;;SAMSUNG: CL21C222JBFNNNG; Component_Class: Capacitor; Status_I: Production; Status_II: Active; Tolerance_Pct: 5; Voltage_Rating_V: 50; Capacitance_F: 2.2E-9; KK: ECK+2N250VXXJ; Value: 2n2; SMD: 1; ComponentLink2URL: i:\datasheets\ECK+1N50VXXJ_Yageo.pdf; ComponentLink2Description: ECK+1N50VXXJ_Yageo.pdf; ComponentLink3URL: i:\datasheets\ECK+2N250VXXJ_SamsungEN100.pdf; ComponentLink3Description: ECK+2N250VXXJ_SamsungEN100.pdf; ComponentLink4URL: i:\DataSheets\ECK+2N250VXXJ_2_SamsungEN100.pdf; ComponentLink4Description: ECK+2N250VXXJ_2_SamsungEN100.pdf; Dielectric_Type: NP0/C0G; ComponentLink1URL: heliosgreen://v1/hegMT/5-MT/Classes(343)/Folders/OpenForm?RecordNumbers=[380372]; ComponentLink1Description: Helios
DS5 = EDS+BAT54SXX0: D; Schottky; 30V; 0.2A; 2x;; Manufacturer: Diotec: BAT54S;;Philips: BAT54S,235;;FAI: BAT54S;;DIODES INC: BAT54S-7-F;;NXP: BAT54S,235; Component_Class: Diode; Status_I: Production; Status_II: Active; Multiplicity: 2; Current_Rating_A: 0.2; Reverse_Voltage_Rating_V: 30; KK: EDS+BAT54SXX0; Value: BAT54S; SMD: 1; ComponentLink2URL: i:\DataSheets\EDS+BAT54SXX0_Vishay.pdf; ComponentLink2Description: EDS+BAT54SXX0_Vishay.pdf; ComponentLink3URL: i:\DataSheets\EDS+BAT54SXX0_Fairchild.pdf; ComponentLink3Description: EDS+BAT54SXX0_Fairchild.pdf; ComponentLink4URL: i:\DataSheets\EDS+BAT54SXX0_Diodes.pdf; ComponentLink4Description: EDS+BAT54SXX0_Diodes.pdf; ComponentLink5URL: I:\datasheets\EDS+BAT54SXX0_NxpEN100.pdf; ComponentLink5Description: EDS+BAT54SXX0_NxpEN100.pdf; ComponentLink6URL: I:\DataSheets\EDS+BAT54SXX0_DiotecEN100.pdf; ComponentLink6Description: EDS+BAT54SXX0_DiotecEN100.pdf; Diode_Type: Schottky; ComponentLink1URL: heliosgreen://v1/hegMT/5-MT/Classes(343)/Folders/OpenForm?RecordNumbers=[380625]; ComponentLink1Description: Helios
R14 R16 R18 R32 = ER+10K0.1WXXF: R; 10k; 0.125W; 1%; 150V; Thick Film; ±100ppm/K; 1x;; Manufacturer: VISHAY: CRCW0805 10KOHM TK100 1%;;AVX: CR21-1002F-T;;BC Components: MCU0805-50 1% P5 10k;;YAGEO: RC0805FR-0710KL;;PANASONIC: ERJ 6EN F 1002 V;;HaS Lanskroun: CMF0805 10k 1% 100ppm/K;;ASJ: CR21-1002-FL; Component_Class: Resistor; Status_I: Production; Status_II: Active; Tolerance_Pct: 1; Voltage_Rating_V: 150; Resistance_Ohm: 10000; Power_Rating_W: 0.125; Temperature_Coefficient_PPMpK: ±100; KK: ER+10K0.1WXXF; Value: 10k; SMD: 1; ComponentLink2URL: i:\DataSheets\ER+0.1WXXF_Yageo.pdf; ComponentLink2Description: ER+0.1WXXF_Yageo.pdf; Multiplicity: 1; Resistor_Type: Thick Film; ComponentLink1URL: heliosgreen://v1/hegMT/5-MT/Classes(343)/Folders/OpenForm?RecordNumbers=[381481]; ComponentLink1Description: Helios
R15 = ER+47R0.1WXXF: R; 47R; 0.125W; 1%; 150V; Thick Film; ±100ppm/K; 1x;; KK: ER+47R0.1WXXF
R17 = 54R9: R; 54R9; 62.5mW; 0.1%; 50V; Thin Film; ±25ppm/K; 1x;; Value: 54R9; ComponentLink1Description: Datasheet; ComponentLink1URL: https://bg.farnell.com/panasonic/era6aeb49r9v/res-0805-49r9-0-125w-metal-film/dp/1810372
TP11-TP13 = EJ+TESTPOINTXX0: as TP7 on sheet filter; KK: EJ+TESTPOINTXX0; Value: Test Point; SMD: 1; ComponentLink2URL: i:\datasheets\EJ+TESTPOINTXX0_HarwinEN100.pdf; ComponentLink2Description: EJ+TESTPOINTXX0_HarwinEN100.pdf; ComponentLink3URL: i:\datasheets\EJ+TESTPOINTXX0_BoardWareEN100.pdf; ComponentLink3Description: EJ+TESTPOINTXX0_BoardWareEN100.pdf; Mounting_Style: PCB; Connector_Family: Test Point; Plating: Tin; Connector_Part: Contact; ComponentLink1URL: heliosgreen://v1/hegMT/5-MT/Classes(343)/Folders/OpenForm?RecordNumbers=[5618398]; ComponentLink1Description: Helios; System: Connector
U4 = AD8421BRZ: High Performance, Low Power, Precision Instrumentation Amplifier
U5 = EU+OPA2863DRXX0: IC; Opamp; 2.7V; 12.6V; 2x;; Manufacturer: Texas Instruments: OPA2863DR; Note: Dual 50MHz, 105V/µs, R-to-R, Precision Op Amps;Pin to pin compatible cheaper alternative of EU+LT6221CS8XX0; Status_I: Production; Status_II: Active; Multiplicity: 2; Vmin_V: 2.7; Vmax_V: 12.6; KK: EU+OPA2863DRXX0; Value: OPA2863DR; Component_Class: IC; SMD: 1; ComponentLink2URL: I:\DataSheets\EU+OPA2863DRXX0_TexasInstrumentsEN100.pdf; ComponentLink2Description: EU+OPA2863DRXX0_TexasInstrumentsEN100.pd; IC_Type: Opamp; ComponentLink1URL: heliosgreen://v1/hegMT/5-MT/Classes(343)/Folders/OpenForm?RecordNumbers=[21742645]; ComponentLink1Description: Helios

## Sheet cjc.SchDoc: tclogger
size A4; Date: 2024-05-30; CheckedBy: Boris Botev; DrawnBy: Iliyan Antov; Organization: Medical Technologies CZ a.s.; Revision: 100; SheetNumber: 8; SheetTotal: 10; Version1: N/A; Version2: N/A; Version3: N/A; Change1description: N/A; Change2description: N/A; Change3description: N/A; Change1DrawnBy: N/A; Change2DrawnBy: N/A; Change3DrawnBy: N/A; Change1CheckedBy: N/A; Change2CheckedBy: N/A; Change3CheckedBy: N/A; PreviusVersion_Chng1: N/A; PreviusVersion_Chng2: N/A; PreviusVersion_Chng3: N/A; Variant1description: Standard assembly; Variant2description: N/A; Variant3description: N/A; Variant4description: N/A; PrimaryCard1: XXXxxxXXX; PrimaryCard2: N/A; PrimaryCard3: N/A; PrimaryCard4: N/A; SPICEModelCacheUGHFLKTA: <root> / <DocumentId>UGHFLKTA</DocumentId> / <CacheFrame Number="0"> / <Model Name="cl32b106kbjnnn" Kind="CKT"> / <Text>* CL32B106KBJNNN Multilayer Ceramic Capacitor Spice Model / *----------------------------------------------------------------------------------------------- / * Model Generated by Samsung Electro-Mechanics / * Samsung Spice Model Version 4.0 / * Products : Multilayer Ceramic Capacitor(General) / *----------------------------------------------------------------------------------------------- / * Characteristics : / * / *     Nominal Capacitance = 10uF / *     Capacitance Tolerance = +/-10% / *     TCC = X7R(-55 ~ +125 Cels.) / *     Rated Voltage = 50Vdc / *     Size = 1210(unit:inch), 3225(unit:mm) / *     Length = 3.20 +/-0.30 mm / *     Width = 2.50 +/-0.20 mm / *     Thickness = 2.50 +/-0.20 mm / *     Measurement Temperature : 25Cels. / *     DC bias Value = 0V / *     Frequency : 100Hz ~ 6GHz / *----------------------------------------------------------------------------------------------- / * External Node Assignments : / * / *  1  o---||---o  2 / * / *----------------------------------------------------------------------------------------------- / .SUBCKT CL32B106KBJNNN 1 2 / C1 1 3 9.44968E-06 / C16 17 18 2.53303E-04 / C17 18 19 4.31538E-04 / C18 19 20 3.87143E-03 / C19 20 21 4.05486E-04 / C2 3 4 3.89833E-04 / C20 21 22 2.20709E-04 / C21 22 23 2.77761E-04 / C22 23 24 2.53303E-04 / C23 24 25 1.34605E-05 / C24 25 26 2.30531E-05 / C25 26 27 1.16610E-06 / C26 27 28 4.91406E-11 / C27 28 2 4.09488E-11 / C3 4 5 5.39533E-04 / C4 5 6 5.73260E-04 / C5 6 7 5.11364E-04 / C6 7 8 1.93016E-04 / C7 8 9 1.00000E-10 / C8 9 10 1.00000E-10 / R1 1 3 1.00000E+08 / R11 12 13 2.42949E-02 / R12 13 14 9.10435E-02 / R13 14 15 1.00000E-06 / R14 15 16 1.00000E-06 / R15 16 17 1.00000E-06 / R16 17 18 1.00000E-06 / R17 18 19 7.62309E-04 / R18 19 20 1.20099E-04 / R19 20 21 5.28440E-04 / R2 3 4 3.45620E+00 / R20 21 22 1.50623E-04 / R21 22 23 4.44357E-05 / R22 23 24 1.00000E-06 / R23 24 25 1.36432E-02 / R24 25 26 6.31685E-03 / R25 26 27 1.00465E-02 / R26 27 28 2.29510E+00 / R27 28 2 6.94002E-01 / R3 4 5 3.47991E-01 / R4 5 6 4.97604E-02 / R5 6 7 9.12642E-03 / R6 7 8 2.25502E-03 / R7 8 9 1.00000E-06 / R8 9 10 1.00000E-06 / R9 10 11 1.05460E-03 / L10 11 12 1.83919E-10 / L11 12 13 2.29964E-10 / L12 13 14 6.97785E-11 / L13 14 15 1.00000E-10 / L14 15 16 1.00000E-10 / L15 16 17 1.00000E-10 / L16 17 18 1.00000E-10 / L17 18 19 1.39420E-10 / L18 19 20 1.12292E-11 / L19 20 21 4.19321E-11 / L20 21 22 4.59803E-11 / L21 22 23 1.53628E-11 / L22 23 24 1.00000E-10 / L23 24 25 1.99071E-10 / L24 25 26 4.97469E-11 / L25 26 27 3.21804E-10 / L26 27 28 6.99616E-11 / L27 28 2 2.09205E-11 / .ENDS CL32B106KBJNNN</Text> / </Model> / </CacheFrame> / </root>; DocumentName: Docname
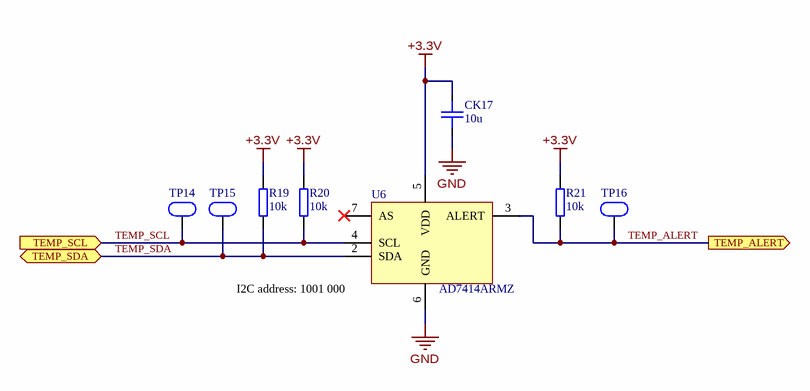
[diagram p7: cjc.SchDoc]

### Parts
CK17  10u  [CAPC3225X27N(SMC1210)]
R19  10k  [RESC2012X06N(SMR0805)]
R20  10k  [RESC2012X06N(SMR0805)]
R21  10k  [RESC2012X06N(SMR0805)]
TP14  Test Point  [SMD_Testpoint_Onelayer]  (value not drawn)
TP15  Test Point  [SMD_Testpoint_Onelayer]  (value not drawn)
TP16  Test Point  [SMD_Testpoint_Onelayer]  (value not drawn)
U6  AD7414ARMZ  [RM_8(MSOP-8)]

### Ports
TEMP_ALERT (out), TEMP_SCL (in), TEMP_SDA (bidir)

### Nets
+3.3V: CK17.1 R19.2 R20.2 R21.2 U6.5(VDD)
GND: CK17.2 U6.6(GND)
TEMP_ALERT: R21.1 TP16.1 U6.3(ALERT) ; port TEMP_ALERT
TEMP_SCL: R20.1 TP14.1 U6.4(SCL) ; port TEMP_SCL
TEMP_SDA: R19.1 TP15.1 U6.2(SDA) ; port TEMP_SDA

Not connected (* = marked no-connect by the designer): U6 7(AS)*

### Notes on the sheet
- (near U6) I2C address: 1001 000
- Číslo výkresu /drawing number/:
- Nazev listu/sheet name/:
- DPS projekt/PCB project/:
- Kreslil /drawn by/ :
- Kontroloval /checked by/:
- Datum /date/:
- List /sheet/:
- /

### Library data of the parts
CK17 = ECK+10U50VXX0: C; 10u; 50V; 10%; X7R; ??;; Manufacturer: Murata: GRM32ER71H106KA12L;;Samsung Electro-mechanics: CL32B106KBJNNNE; Note: X7R, 9uF @ 10V, 5uF @ 30V, 2.5uF @ 50V; Component_Class: Capacitor; Status_I: Production; Status_II: Active; Tolerance_Pct: 10; Voltage_Rating_V: 50; Capacitance_F: 1E-5; KK: ECK+10U50VXX0; Value: 10u; SMD: 1; ComponentLink2URL: I:\DataSheets\ECK+10U50VXX0_MurataEN100.pdf; ComponentLink2Description: ECK+10U50VXX0_MurataEN100.pdf; ComponentLink3URL: I:\DataSheets\ECK+10U50VXX0_SamsungEN100.pdf; ComponentLink3Description: ECK+10U50VXX0_SamsungEN100.pdf; Dielectric_Type: X7R; ComponentLink1URL: heliosgreen://v1/hegMT/5-MT/Classes(343)/Folders/OpenForm?RecordNumbers=[10658879]; ComponentLink1Description: Helios
R19-R21 = ER+10K0.1WXXF: R; 10k; 0.125W; 1%; 150V; Thick Film; ±100ppm/K; 1x;; Manufacturer: VISHAY: CRCW0805 10KOHM TK100 1%;;AVX: CR21-1002F-T;;BC Components: MCU0805-50 1% P5 10k;;YAGEO: RC0805FR-0710KL;;PANASONIC: ERJ 6EN F 1002 V;;HaS Lanskroun: CMF0805 10k 1% 100ppm/K;;ASJ: CR21-1002-FL; Component_Class: Resistor; Status_I: Production; Status_II: Active; Tolerance_Pct: 1; Voltage_Rating_V: 150; Resistance_Ohm: 10000; Power_Rating_W: 0.125; Temperature_Coefficient_PPMpK: ±100; KK: ER+10K0.1WXXF; Value: 10k; SMD: 1; ComponentLink2URL: i:\DataSheets\ER+0.1WXXF_Yageo.pdf; ComponentLink2Description: ER+0.1WXXF_Yageo.pdf; Multiplicity: 1; Resistor_Type: Thick Film; ComponentLink1URL: heliosgreen://v1/hegMT/5-MT/Classes(343)/Folders/OpenForm?RecordNumbers=[381481]; ComponentLink1Description: Helios
TP14-TP16 = EJ+TESTPOINTXX0: Con; Test Point; 1x; PCB; ??; ??V; ??A; ??; Tin; Contact;; Manufacturer: Harwin: S1751-46R; Component_Class: Connector; Status_I: Production; Status_II: Active; Multiplicity: 1; KK: EJ+TESTPOINTXX0; Value: Test Point; SMD: 1; ComponentLink2URL: i:\datasheets\EJ+TESTPOINTXX0_HarwinEN100.pdf; ComponentLink2Description: EJ+TESTPOINTXX0_HarwinEN100.pdf; ComponentLink3URL: i:\datasheets\EJ+TESTPOINTXX0_BoardWareEN100.pdf; ComponentLink3Description: EJ+TESTPOINTXX0_BoardWareEN100.pdf; Mounting_Style: PCB; Connector_Family: Test Point; Plating: Tin; Connector_Part: Contact; ComponentLink1URL: heliosgreen://v1/hegMT/5-MT/Classes(343)/Folders/OpenForm?RecordNumbers=[5618398]; ComponentLink1Description: Helios; System: Connector
U6 = EU+AD7414ARMZXX0: Sen; Temperature [°C]; Digital/PWM; 0.5%;; Manufacturer: ANALOG DEVICES: AD7414ARMZ-0;;ANALOG DEVICES: AD7414ARMZ-0REEL7; Component_Class: Sensor; Status_I: Production; Status_II: Active; Tolerance_Pct: 0.5; KK: EU+AD7414ARMZXX0; Value: AD7414ARMZ; SMD: 1; ComponentLink2URL: i:\datasheets\EU+AD7414ARMZXX0_ADEN100.pdf; ComponentLink2Description: EU+AD7414ARMZXX0_ADEN100.pdf; Physical_Quantity: Temperature [°C]; Sensor_Output: Digital/PWM; ComponentLink1URL: heliosgreen://v1/hegMT/5-MT/Classes(343)/Folders/OpenForm?RecordNumbers=[7785359]; ComponentLink1Description: Helios